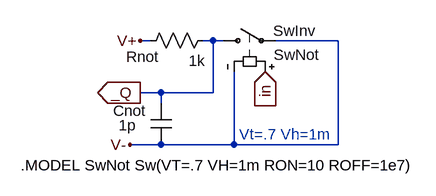
[diagram p0: schematic NotH.asc]
NotH.asc, the LTspice schematic file:
Version 4
SHEET 1 880 680
WIRE -112 176 -128 176
WIRE -96 256 -128 256
WIRE -96 272 -96 256
WIRE -96 336 -144 336
WIRE -16 176 -32 176
WIRE -16 256 -96 256
WIRE -16 256 -16 176
WIRE 0 176 -16 176
WIRE 16 336 -96 336
WIRE 16 336 16 224
WIRE 176 176 80 176
WIRE 176 336 16 336
WIRE 176 336 176 176
FLAG -128 256 _Q
IOPIN -128 256 Out
FLAG 64 224 in
IOPIN 64 224 In
FLAG -144 336 V-
FLAG -128 176 V+
SYMBOL sw -16 176 R270
WINDOW 0 15 92 VRight 0
WINDOW 3 -22 93 VRight 0
SYMATTR InstName SwInv
SYMATTR Value SwNot
SYMBOL cap -112 272 R0
WINDOW 0 -58 12 Left 0
WINDOW 3 -49 34 Left 0
WINDOW 39 -97 57 Left 0
SYMATTR InstName Cnot
SYMATTR Value 1p
SYMBOL res -16 160 R90
WINDOW 0 56 108 VBottom 0
WINDOW 3 31 25 VTop 0
SYMATTR InstName Rnot
SYMATTR Value 1k
TEXT -312 368 Left 0 !.MODEL SwNot Sw(VT=.7 VH=1m RON=10 ROFF=1e7)
TEXT 24 320 Left 0 ;Vt=.7 Vh=1m

The netlist it stands for:
* NotH.asc
SwInv _Q V- in V- SwNot
Cnot _Q V- 1p
Rnot _Q V+ 1k
.MODEL SwNot Sw(VT=.7 VH=1m RON=10 ROFF=1e7)
* Vt=.7 Vh=1m
.backanno
.end